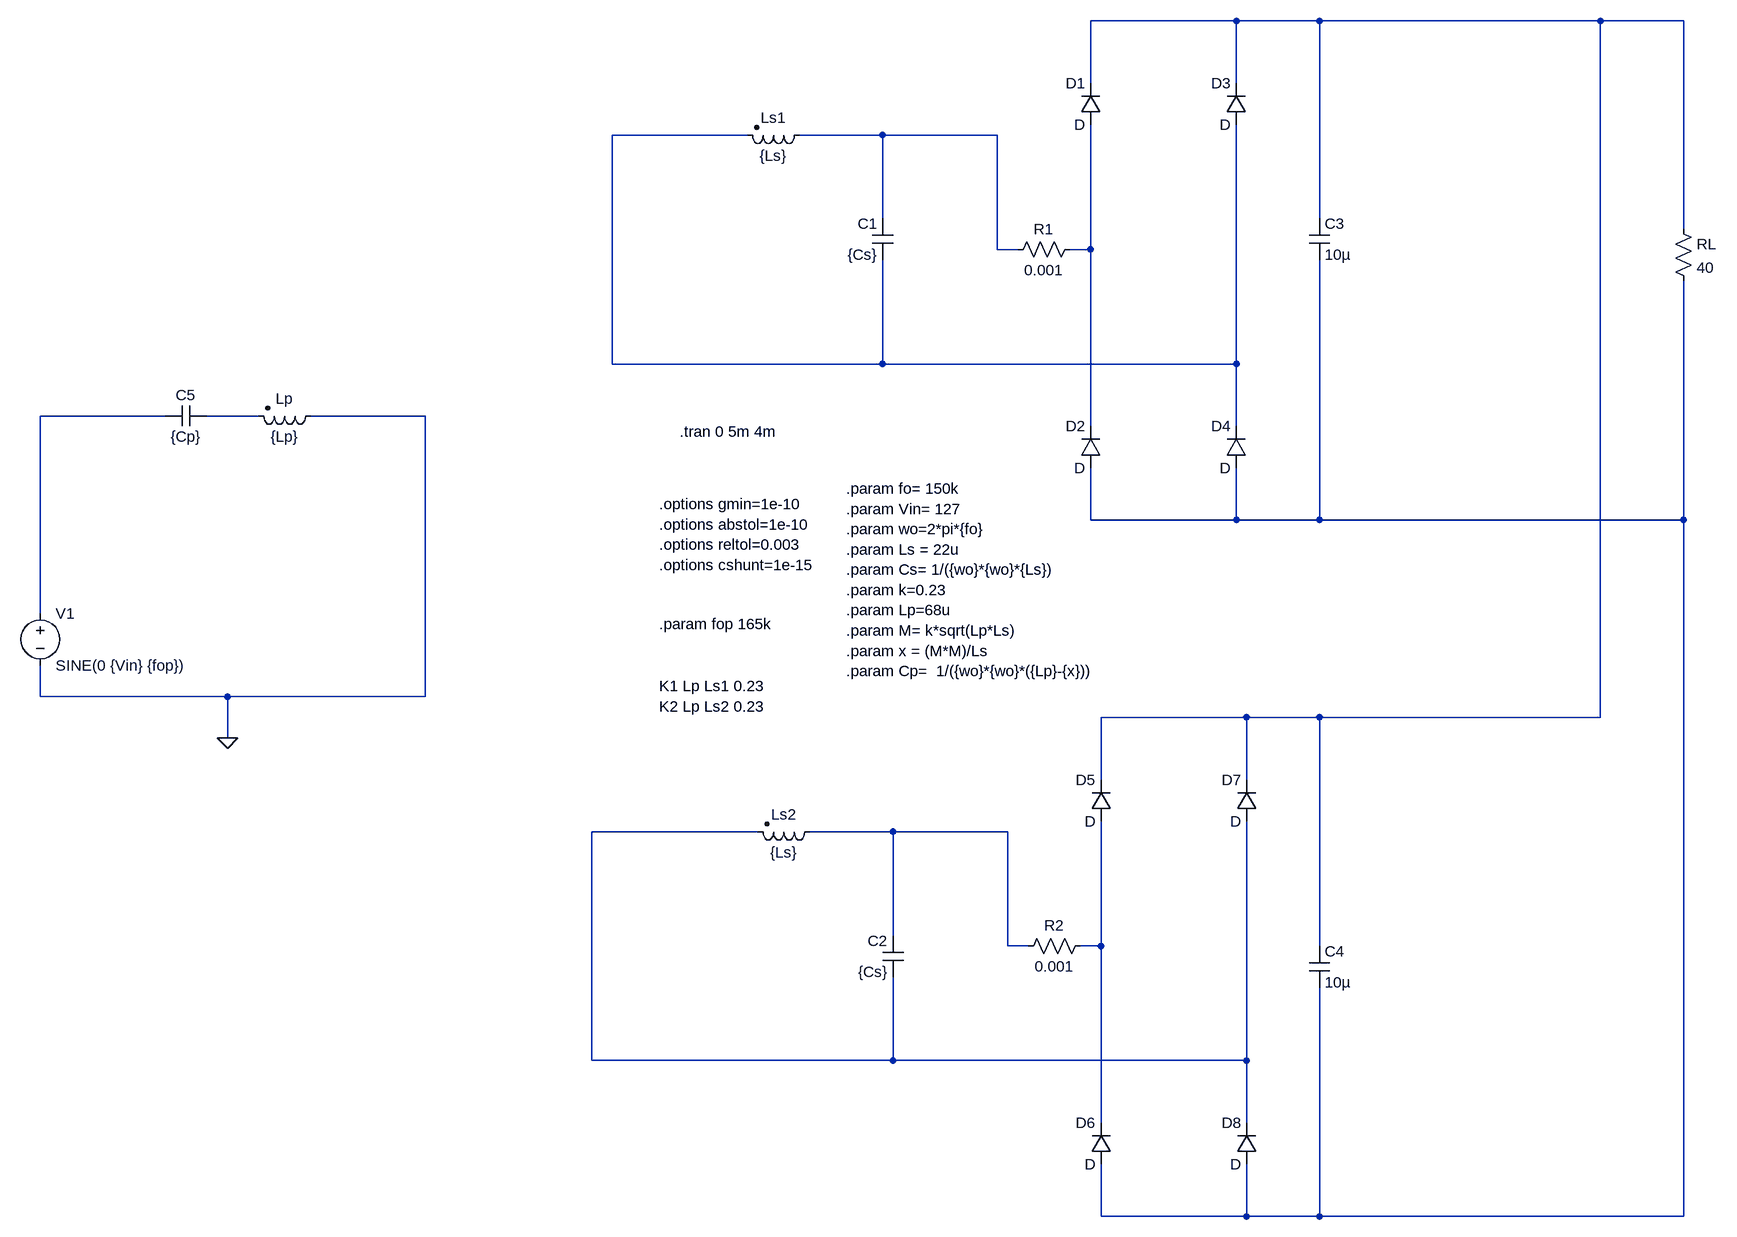
[diagram p0: schematic parallel-compensation-parellel_Tx-Rx.asc]
parallel-compensation-parellel_Tx-Rx.asc, the LTspice schematic file:
Version 4
SHEET 1 2752 1872
WIRE 1936 -240 1712 -240
WIRE 2064 -240 1936 -240
WIRE 2496 -240 2064 -240
WIRE 2624 -240 2496 -240
WIRE 1712 -144 1712 -240
WIRE 1936 -144 1936 -240
WIRE 1184 -64 976 -64
WIRE 1392 -64 1264 -64
WIRE 1568 -64 1392 -64
WIRE 1392 64 1392 -64
WIRE 2064 64 2064 -240
WIRE 2624 80 2624 -240
WIRE 1568 112 1568 -64
WIRE 1600 112 1568 112
WIRE 1712 112 1712 -80
WIRE 1712 112 1680 112
WIRE 976 288 976 -64
WIRE 1392 288 1392 128
WIRE 1392 288 976 288
WIRE 1936 288 1936 -80
WIRE 1936 288 1392 288
WIRE 288 368 96 368
WIRE 432 368 352 368
WIRE 688 368 512 368
WIRE 1712 384 1712 112
WIRE 1936 384 1936 288
WIRE 1712 528 1712 448
WIRE 1936 528 1936 448
WIRE 1936 528 1712 528
WIRE 2064 528 2064 128
WIRE 2064 528 1936 528
WIRE 2624 528 2624 160
WIRE 2624 528 2064 528
WIRE 96 672 96 368
WIRE 96 800 96 752
WIRE 384 800 96 800
WIRE 688 800 688 368
WIRE 688 800 384 800
WIRE 1952 832 1728 832
WIRE 2064 832 1952 832
WIRE 2496 832 2496 -240
WIRE 2496 832 2064 832
WIRE 384 864 384 800
WIRE 1728 928 1728 832
WIRE 1952 928 1952 832
WIRE 1200 1008 944 1008
WIRE 1408 1008 1280 1008
WIRE 1584 1008 1408 1008
WIRE 1408 1168 1408 1008
WIRE 1584 1184 1584 1008
WIRE 1616 1184 1584 1184
WIRE 1728 1184 1728 992
WIRE 1728 1184 1696 1184
WIRE 2064 1184 2064 832
WIRE 944 1360 944 1008
WIRE 1408 1360 1408 1232
WIRE 1408 1360 944 1360
WIRE 1952 1360 1952 992
WIRE 1952 1360 1408 1360
WIRE 1728 1456 1728 1184
WIRE 1952 1456 1952 1360
WIRE 1728 1600 1728 1520
WIRE 1952 1600 1952 1520
WIRE 1952 1600 1728 1600
WIRE 2064 1600 2064 1248
WIRE 2064 1600 1952 1600
WIRE 2624 1600 2624 528
WIRE 2624 1600 2064 1600
FLAG 384 864 0
SYMBOL voltage 96 656 R0
WINDOW 123 0 0 Left 0
WINDOW 39 0 0 Left 0
SYMATTR InstName V1
SYMATTR Value SINE(0 {Vin} {fop})
SYMBOL ind2 1280 -80 R90
WINDOW 0 5 56 VBottom 2
WINDOW 3 32 56 VTop 2
SYMATTR InstName Ls1
SYMATTR Value {Ls}
SYMATTR Type ind
SYMBOL cap 1408 128 R180
WINDOW 0 24 56 Left 2
WINDOW 3 24 8 Left 2
SYMATTR InstName C1
SYMATTR Value {Cs}
SYMBOL diode 1728 -80 R180
WINDOW 0 24 64 Left 2
WINDOW 3 24 0 Left 2
SYMATTR InstName D1
SYMBOL diode 1728 448 R180
WINDOW 0 24 64 Left 2
WINDOW 3 24 0 Left 2
SYMATTR InstName D2
SYMBOL diode 1952 -80 R180
WINDOW 0 24 64 Left 2
WINDOW 3 24 0 Left 2
SYMATTR InstName D3
SYMBOL diode 1952 448 R180
WINDOW 0 24 64 Left 2
WINDOW 3 24 0 Left 2
SYMATTR InstName D4
SYMBOL res 2608 64 R0
SYMATTR InstName RL
SYMATTR Value 40
SYMBOL ind2 1296 992 R90
WINDOW 0 5 56 VBottom 2
WINDOW 3 32 56 VTop 2
SYMATTR InstName Ls2
SYMATTR Value {Ls}
SYMATTR Type ind
SYMBOL cap 1424 1232 R180
WINDOW 0 24 56 Left 2
WINDOW 3 24 8 Left 2
SYMATTR InstName C2
SYMATTR Value {Cs}
SYMBOL diode 1744 992 R180
WINDOW 0 24 64 Left 2
WINDOW 3 24 0 Left 2
SYMATTR InstName D5
SYMBOL diode 1744 1520 R180
WINDOW 0 24 64 Left 2
WINDOW 3 24 0 Left 2
SYMATTR InstName D6
SYMBOL diode 1968 992 R180
WINDOW 0 24 64 Left 2
WINDOW 3 24 0 Left 2
SYMATTR InstName D7
SYMBOL diode 1968 1520 R180
WINDOW 0 24 64 Left 2
WINDOW 3 24 0 Left 2
SYMATTR InstName D8
SYMBOL cap 2048 64 R0
SYMATTR InstName C3
SYMATTR Value 10µ
SYMBOL cap 2048 1184 R0
SYMATTR InstName C4
SYMATTR Value 10µ
SYMBOL ind2 528 352 R90
WINDOW 0 5 56 VBottom 2
WINDOW 3 32 56 VTop 2
SYMATTR InstName Lp
SYMATTR Value {Lp}
SYMATTR Type ind
SYMBOL cap 352 352 R90
WINDOW 0 0 32 VBottom 2
WINDOW 3 32 32 VTop 2
SYMATTR InstName C5
SYMATTR Value {Cp}
SYMBOL res 1696 96 R90
WINDOW 0 0 56 VBottom 2
WINDOW 3 32 56 VTop 2
SYMATTR InstName R1
SYMATTR Value 0.001
SYMBOL res 1712 1168 R90
WINDOW 0 0 56 VBottom 2
WINDOW 3 32 56 VTop 2
SYMATTR InstName R2
SYMATTR Value 0.001
TEXT 1080 392 Left 2 !.tran 0 5m 4m
TEXT 1048 688 Left 2 !.param fop 165k
TEXT 1336 480 Left 2 !.param fo= 150k\n.param Vin= 127\n.param wo=2*pi*{fo}\n.param Ls = 22u\n.param Cs= 1/({wo}*{wo}*{Ls})\n.param k=0.23\n.param Lp=68u\n.param M= k*sqrt(Lp*Ls)\n.param x = (M*M)/Ls\n.param Cp=  1/({wo}*{wo}*({Lp}-{x}))
TEXT 1048 504 Left 2 !.options gmin=1e-10\n.options abstol=1e-10\n.options reltol=0.003\n.options cshunt=1e-15
TEXT 1048 784 Left 2 !K1 Lp Ls1 0.23\nK2 Lp Ls2 0.23

The netlist it stands for:
* parallel-compensation-parellel_Tx-Rx.asc
V1 N005 0 SINE(0 {Vin} {fop})
Ls1 N003 N002 {Ls}
C1 N002 N003 {Cs}
D1 N004 N001 D
D2 N007 N004 D
D3 N002 N001 D
D4 N007 N002 D
RL N001 N007 40
Ls2 N009 N008 {Ls}
C2 N008 N009 {Cs}
D5 N010 N001 D
D6 N007 N010 D
D7 N008 N001 D
D8 N007 N008 D
C3 N001 N007 10µ
C4 N001 N007 10µ
Lp 0 N006 {Lp}
C5 N006 N005 {Cp}
R1 N004 N003 0.001
R2 N010 N009 0.001
.model D D
.lib standard.dio
.tran 0 5m 4m
.param fop 165k
.param fo= 150k
.param Vin= 127
.param wo=2*pi*{fo}
.param Ls = 22u
.param Cs= 1/({wo}*{wo}*{Ls})
.param k=0.23
.param Lp=68u
.param M= k*sqrt(Lp*Ls)
.param x = (M*M)/Ls
.param Cp=  1/({wo}*{wo}*({Lp}-{x}))
.options gmin=1e-10
.options abstol=1e-10
.options reltol=0.003
.options cshunt=1e-15
K1 Lp Ls1 0.23
K2 Lp Ls2 0.23
.backanno
.end